# Altium schematic sheet ftdi.SchDoc
size A4; SheetNumber: 3; SheetTotal: 6
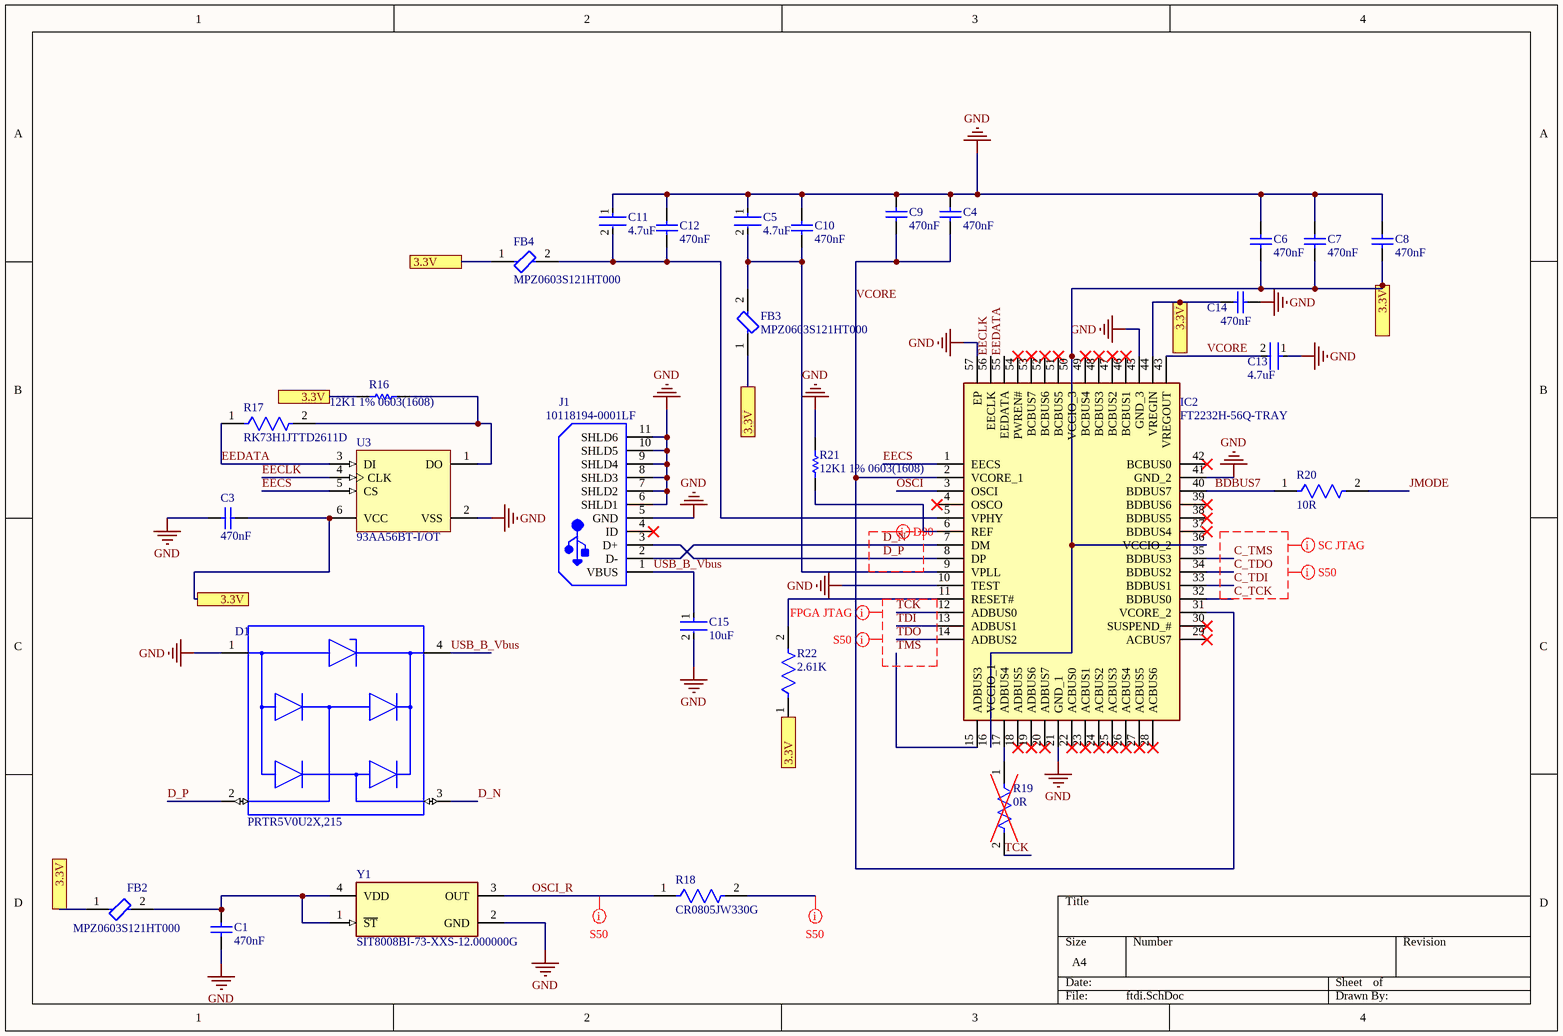
[diagram p0: ftdi.SchDoc]

## Parts
C1  470nF  [CAPC2013X140X50ML20T25]
C3  470nF  [CAPC2013X140X50ML20T25]
C4  470nF  [CAPC2013X140X50ML20T25]
C5  4.7uF  [FP-GRM155-0_2-MFG]
C6  470nF  [CAPC2013X140X50ML20T25]
C7  470nF  [CAPC2013X140X50ML20T25]
C8  470nF  [CAPC2013X140X50ML20T25]
C9  470nF  [CAPC2013X140X50ML20T25]
C10  470nF  [CAPC2013X140X50ML20T25]
C11  4.7uF  [FP-GRM155-0_2-MFG]
C12  470nF  [CAPC2013X140X50ML20T25]
C13  4.7uF  [FP-GRM155-0_2-MFG]
C14  470nF  [CAPC2013X140X50ML20T25]
C15  10uF  [FP-C0402C106M9PACTU-MFG]
D1  PRTR5V0U2X,215  [FP-SOT143B-MFG]
FB2  MPZ0603S121HT000  [FP-MPZ0603-IPC_C]
FB3  MPZ0603S121HT000  [FP-MPZ0603-IPC_C]
FB4  MPZ0603S121HT000  [FP-MPZ0603-IPC_C]
IC2  FT2232H-56Q-TRAY  [QFN50P800X800X100-57N-D]
J1  10118194-0001LF  [FCI-10118194-0001LF-5_V]
R16  12K1 1% 0603(1608)  [RESC0603(1608)_M]
R17  RK73H1JTTD2611D  [FP-RK73H1J-IPC_B]
R18  CR0805JW330G  [FP-CR0805-IPC_C]
R19  0R  [FP-HCJ0603-MFG]  (no BOM)
R20  10R  [FP-CR1206-IPC_B]
R21  12K1 1% 0603(1608)  [RESC0603(1608)_M]
R22  2.61K  [FP-RK73H1J-IPC_B]
U3  93AA56BT-I/OT  [SOT-23-OT6_N]
Y1  SIT8008BI-73-XXS-12.000000G  [FP-SiT8008-7-MFG]

## Ports
3.3V (see connector1[2A], connector2[1B], connector2[3A], connector2[4A], connector2[4C], connector2[4D], connector2[5C], connector2[6B], connector2[6D], connector2[7B], CPLD[2B], CPLD[2C], CPLD[3A], CPLD[4C], ftdi[1B], ftdi[1C], ftdi[1D], ftdi[2B], ftdi[3C], ftdi[4B]), 3.3V (see connector1[2A], connector2[1B], connector2[3A], connector2[4A], connector2[4C], connector2[4D], connector2[5C], connector2[6B], connector2[6D], connector2[7B], CPLD[2B], CPLD[2C], CPLD[3A], CPLD[4C], ftdi[1B], ftdi[1C], ftdi[1D], ftdi[2B], ftdi[4B]), 3.3V (see connector1[2A], connector2[1B], connector2[3A], connector2[4A], connector2[4C], connector2[4D], connector2[5C], connector2[6B], connector2[6D], connector2[7B], CPLD[2B], CPLD[2C], CPLD[3A], CPLD[4C], ftdi[1B], ftdi[1C], ftdi[2B], ftdi[3C], ftdi[4B]), 3.3V (see connector1[2A], connector2[1B], connector2[3A], connector2[4A], connector2[4C], connector2[4D], connector2[5C], connector2[6B], connector2[6D], connector2[7B], CPLD[2B], CPLD[2C], CPLD[3A], CPLD[4C], ftdi[1B], ftdi[1D], ftdi[2B], ftdi[3C], ftdi[4B]), 3.3V (see connector1[2A], connector2[1B], connector2[3A], connector2[4A], connector2[4C], connector2[4D], connector2[5C], connector2[6B], connector2[6D], connector2[7B], CPLD[2B], CPLD[2C], CPLD[3A], CPLD[4C], ftdi[1C], ftdi[1D], ftdi[2B], ftdi[3C], ftdi[4B])

## Nets
GND: C1.1 C3.2 C4.1 C5.1 C6.1 C7.1 C8.1 C9.1 C10.1 C11.1 C12.1 C13.1 C14.1 C15.2 D1.1(GND) IC2.10(TEST) IC2.21(GND_1) IC2.41(GND_2) IC2.45(GND_3) IC2.57(EP) J1.5(GND) J1.6(SHLD1) J1.7(SHLD2) J1.8(SHLD3) J1.9(SHLD4) J1.10(SHLD5) J1.11(SHLD6) R21.2 U3.2(VSS) Y1.2(GND)
3.3V: C3.1 C6.2 C7.2 C8.2 C14.2 FB2.1 FB3.1 FB4.1 IC2.16(VCCIO_1) IC2.36(VCCIO_2) IC2.44(VREGIN) IC2.50(VCCIO_3) R16.1 U3.6(VCC) ; port 3.3V
BDBUS7: IC2.40(BDBUS7) R20.1
C_TCK: IC2.32(BDBUS0)
C_TDI: IC2.33(BDBUS1)
C_TDO: IC2.34(BDBUS2)
C_TMS: IC2.35(BDBUS3)
D_N: D1.3(I/O_2) IC2.7(DM) J1.2(D-)
D_P: D1.2(I/O_1) IC2.8(DP) J1.3(D+)
EECLK: IC2.56(EECLK) U3.4(CLK)
EECS: IC2.1(EECS) U3.5(CS)
EEDATA: IC2.55(EEDATA) R17.1 U3.3(DI)
JMODE: R20.2
OSCI: IC2.3(OSCI)
OSCI_R: R18.1 Y1.3(OUT)
TCK: IC2.12(ADBUS0) R19.2
TDI: IC2.13(ADBUS1)
TDO: IC2.14(ADBUS2)
TMS: IC2.15(ADBUS3)
USB_B_Vbus: C15.1 D1.4(VCC) J1.1(VBUS)
VCORE: C4.2 C9.2 C13.2 IC2.2(VCORE_1) IC2.31(VCORE_2) IC2.43(VREGOUT)
NetC1_2: C1.2 FB2.2 Y1.1(~{ST}) Y1.4(VDD)
NetC5_2: C5.2 C10.2 FB3.2 IC2.9(VPLL)
NetC11_2: C11.2 C12.2 FB4.2 IC2.5(VPHY)
NetIC2_6: IC2.6(REF) R21.1
NetIC2_11: IC2.11(RESET#) R22.2
NetIC2_17: IC2.17(ADBUS4) R19.1
NetR16_2: R16.2 R17.2 U3.1(DO)

Not connected (* = marked no-connect by the designer): IC2 4(OSCO)* 18(ADBUS5)* 19(ADBUS6)* 20(ADBUS7)* 22(ACBUS0)* 23(ACBUS1)* 24(ACBUS2)* 25(ACBUS3)* 26(ACBUS4)* 27(ACBUS5)* 28(ACBUS6)* 29(ACBUS7)* 30(SUSPEND_#)* 37(BDBUS4)* 38(BDBUS5)* 39(BDBUS6)* 42(BCBUS0)* 46(BCBUS1)* 47(BCBUS2)* 48(BCBUS3)* 49(BCBUS4)* 51(BCBUS5)* 52(BCBUS6)* 53(BCBUS7)* 54(PWREN#)*; J1 4(ID)*; R18 2; R22 1

## Layout directives
mark named S50: C_TCK, C_TDI, C_TDO, C_TMS, NetR18_2, OSCI_R, TCK, TDI, TDO, TMS
differential pair: D_N, D_P
mark named FPGA JTAG: TCK, TDI, TDO, TMS
mark named SC JTAG: C_TCK, C_TDI, C_TDO, C_TMS

## Library data of the parts
C1 C3 C4 C6-C10 C12 C14 = CMP-2007-04634-1: Manufacturer: AVX Interconnect / Elco; Part Number: 08055C474JAT2A
C5 C11 C13 = CMP-00260-57366380-1: GRM155D71A475ME15D Cap Ceramic Monolithic 4.7uF 10VDC 20% SMD Paper T/R; Capacitance: 4.7µF; Dielectric: X7T; Voltage Rating (DC): 10V; Length: 1mm; Thickness: 500µm; NexarPartId: 57366380; Width: 500µm; Case/Package: 0402; Lifecycle Status: Production
C15 = CMP-03020-034678-1: CAP CER 10UF 6.3V X5R 0402; Tolerance: 20%; Dielectric Material: Ceramic; Voltage Rating: 6.3V; Thickness: 0.028inch; REACH SVHC: No SVHC; RoHS Compliant: Yes; Case Code (Metric): 1005; Lead Free: Lead Free; Length: 0.039inch; Max Operating Temperature: 85°C; Capacitance: 10uF; Voltage Rating (DC): 6.3V; Min Operating Temperature: -55°C; Case/Package: 0402; Mount: Surface Mount; Case Code (Imperial): 0402; Dielectric: X5R; Packaging: Cut Tape; Width: 0.02inch
D1 = CMP-14436-000007-1: TVS DIODE 5.5V SOT143B
FB2-FB4 = CMP-08257-000447-1: CHIP BEADS FOR GENERAL SIGNAL LI; Max Current Rating: 1A; DC Resistance (DCR): 130mR; Number of Lines: 1; Min Operating Temperature: -55°C; Mount: Surface Mount; Case Code (Imperial): 0201; Case Code (Metric): 0603; Max Operating Temperature: 125°C; RoHS Compliant: Yes; Packaging: Cut Tape; Case/Package: 0201
IC2 = FT2232H-56Q-TRAY: Integrated Circuit; Manufacturer_Name: FTDI Chip; Datasheet Link: https://componentsearchengine.com/Datasheets/1/FT2232H-56Q-TRAY.pdf; Height: 1mm; Manufacturer_Part_Number: FT2232H-56Q-TRAY; Mouser Part Number: 895-FT2232H-56Q-TRAY; Mouser Price/Stock: https://www.mouser.co.uk/ProductDetail/FTDI/FT2232H-56Q-TRAY?qs=u4lROS522ZW4g0YyKZT0kg%3D%3D; Arrow Part Number: FT2232H-56Q-TRAY; Arrow Price/Stock: https://www.arrow.com/en/products/ft2232h-56q-tray/ftdi-chip?utm_currency=USD&region=europe
J1 = CMP-2000-05120-1: Micro USB B Type Receptacle, 1.8 A, -55 to 85 degC, 5-Pin SMD, RoHS, Tape and Reel; Manufacturer: Amphenol FCI; Body Orientation: RightAngle; Number of Contacts: 5; Pitch: 0.65mm; Gender: RCP; Rad Hard: No; Package Reference: 10118194-0001LF-5; Mounting: SurfaceMount; Manufacturer URL: http://www.fci.com/; Packaging: CutTape; Datasheet URL: https://datasheet.ciiva.com/26945/getdatasheetpartid-418619-26945695.pdf; Termination Method: Solder; Package Description: 5-Pin Surface Mount Device, Body 8.05 x 5.53 mm, Pitch 0.65 mm; Type: MicroUSBTypeB; Datasheet Version: Rev. A, 10/2011
R16 R21 = CMP-1012-00632-1: 12K1 0.1W 1% 0603 (1608 Metric)  SMD; Case-Metric: 1608; Case-EIA: 0603; Value: 12100.00 Ohm; Power: 0.1 W; Technology: SMT; Tolerance: 1 %
R17 R22 = CMP-04015-095862-1: 2.61kΩ ±0.5% 0.1W Chip Resistor 0603 Thick Film AEC-Q200 Qualified
R18 = CMP-07231-004924-1: Thick Film Chip Resistors 0805 33Ω 0.125W 5% 200ppm/°C; Power Rating: 125mW; Resistance: 33R; Voltage Rating: 150V; Width: 1.25mm; Temperature Coefficient: 200ppm/°C; Case Code (Metric): 2012; Case Code (Imperial): 0805; Termination: SMD/SMT; Height: 0.5mm; Max Operating Temperature: 155°C; Case/Package: 0805; Thickness: 508um; Packaging: Tape and Reel; Min Operating Temperature: -55°C; Length: 2mm; Package Quantity: 10000; Tolerance: 5%
R19 = CMP-26527-000122-1: RES 0 OHM JUMPER 1/4W 0603; Resistance: 0mR; Termination: Wraparound; Mount: Surface Mount; Min Operating Temperature: -55°C; Number of Terminations: 2; Packaging: Tape and Reel; Case Code (Imperial): 0603; Height: 0.021inch; RoHS Compliant: Yes; Width: 0.031inch; Package Quantity: 5000; Max Operating Temperature: 155°C; Radiation Hardening: No; Case/Package: 0603; Length: 0.061inch; Case Code (Metric): 1608
R20 = CMP-07231-003129-1: Thick Film Chip Resistors 1206 10Ω 0.25W 5% 200ppm/°C; Power Rating: 250mW; Voltage Rating: 200V; Width: 0.063inch; Length: 0.126inch; Package Quantity: 10000; Mount: Surface Mount; Resistance: 10R; Packaging: Tape and Reel; Number of Terminations: 2; Termination: SMD/SMT; Max Operating Temperature: 155°C; Temperature Coefficient: 200ppm/°C; Max Power Dissipation: 250mW; Composition: Thick Film; Height: 0.03inch; Case Code (Imperial): 1206; Thickness: 610um; Features: Moisture Resistant; Case/Package: 1206; Contact Plating: Tin; Radiation Hardening: No; Min Operating Temperature: -55°C; Tolerance: 5%; Case Code (Metric): 3216
U3 = CMP-0162-00347-1: 2K, 128x16-bit, 1.8V Microwire Serial EEPROM, 6-Pin SOT-23, Industrial Temperature, Tape and Reel; DatasheetVersion: revF, May-2008; PackageDescription: 6-Lead Plastic Small Outline Transistor (OT) [SOT-23]; PackageReference: SOT-23-OT6; Code_IPC: SOT26A-6; PackageVersion: revBB, Aug-2009
Y1 = CMP-25159-260607-1: MEMS OSC XO 12.0000MHZ H/LV-CMOS; RoHS Compliant: Yes; Series: SIT8008B